# EAGLE design LocationMapper (EAGLE 8.6.0)
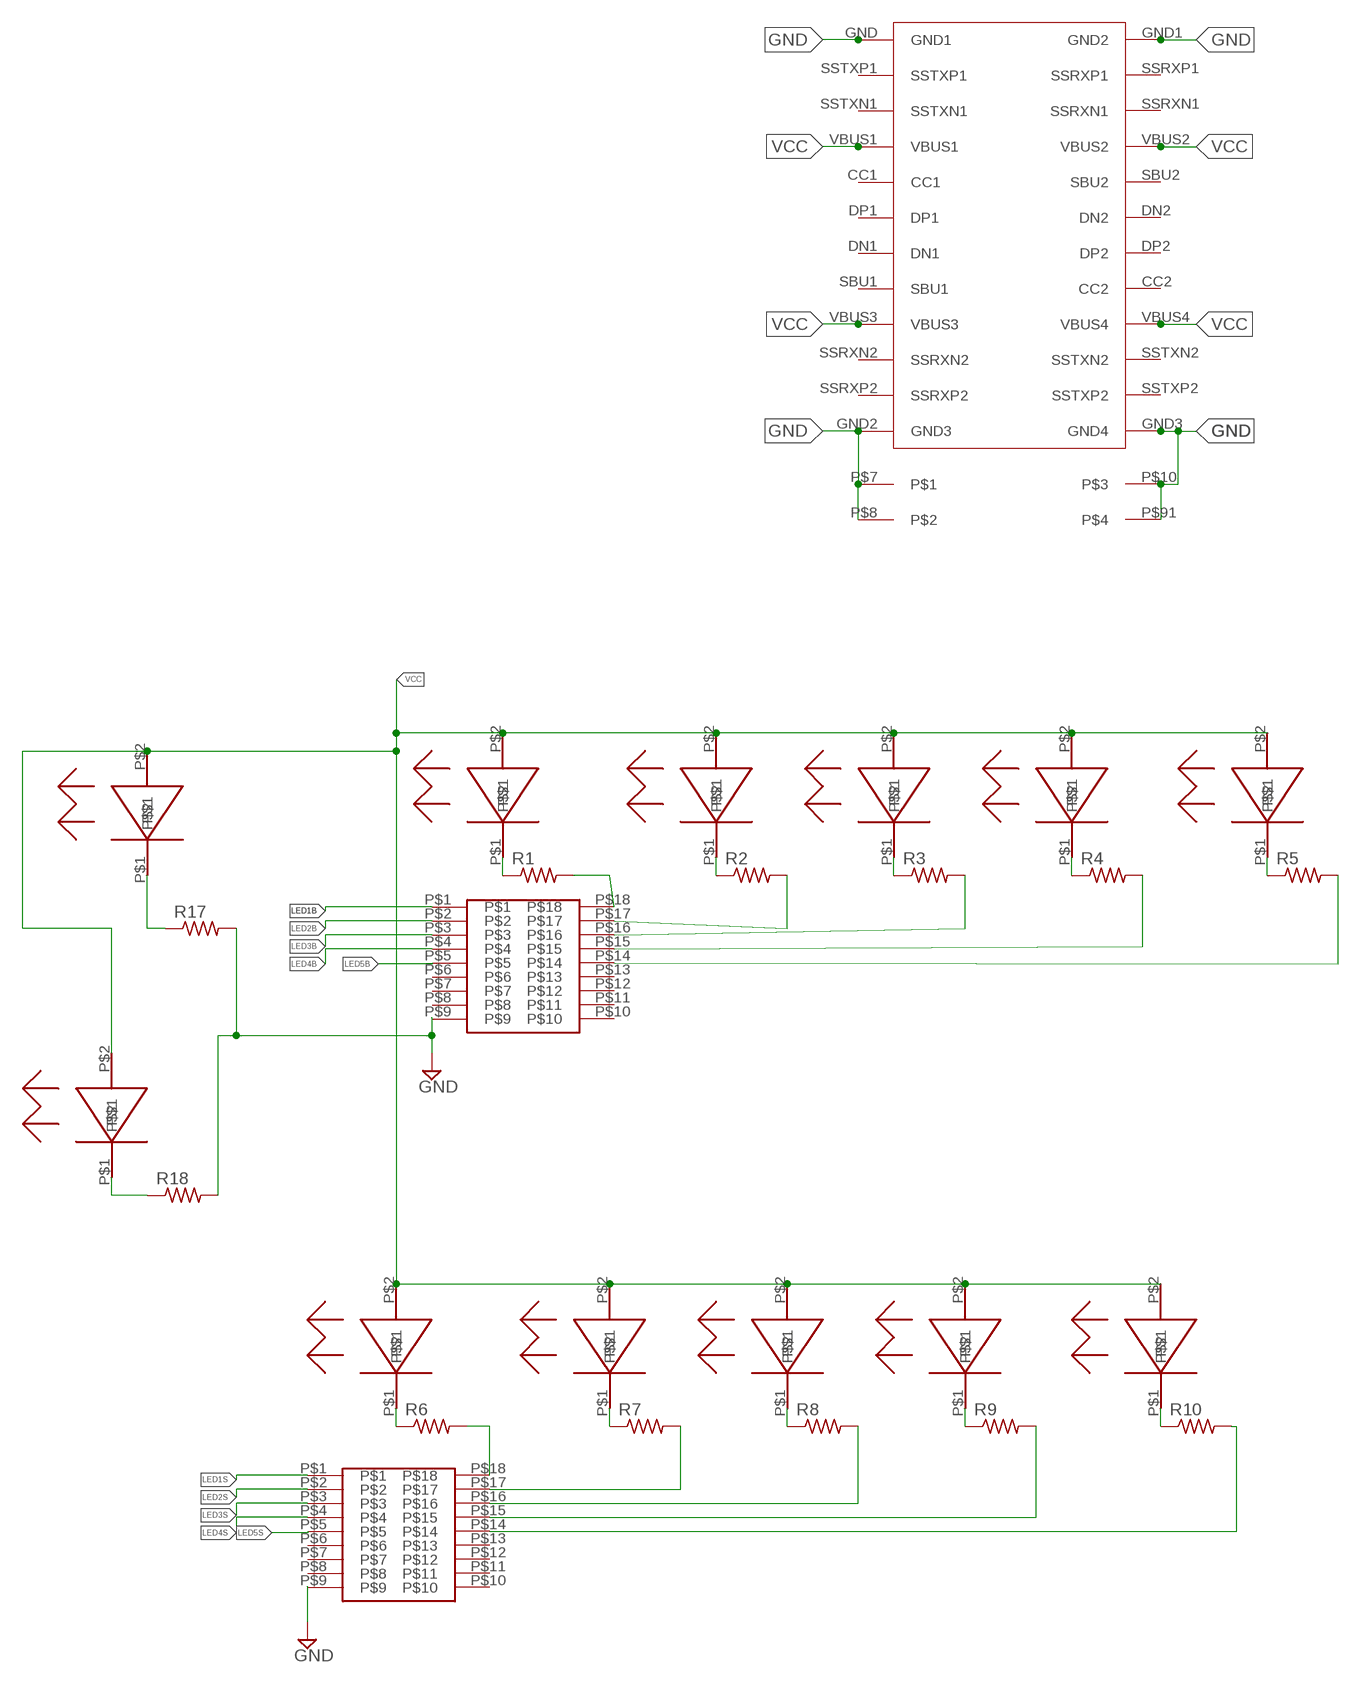
[diagram p0: schematic, sheet 1, part 1 of 2]
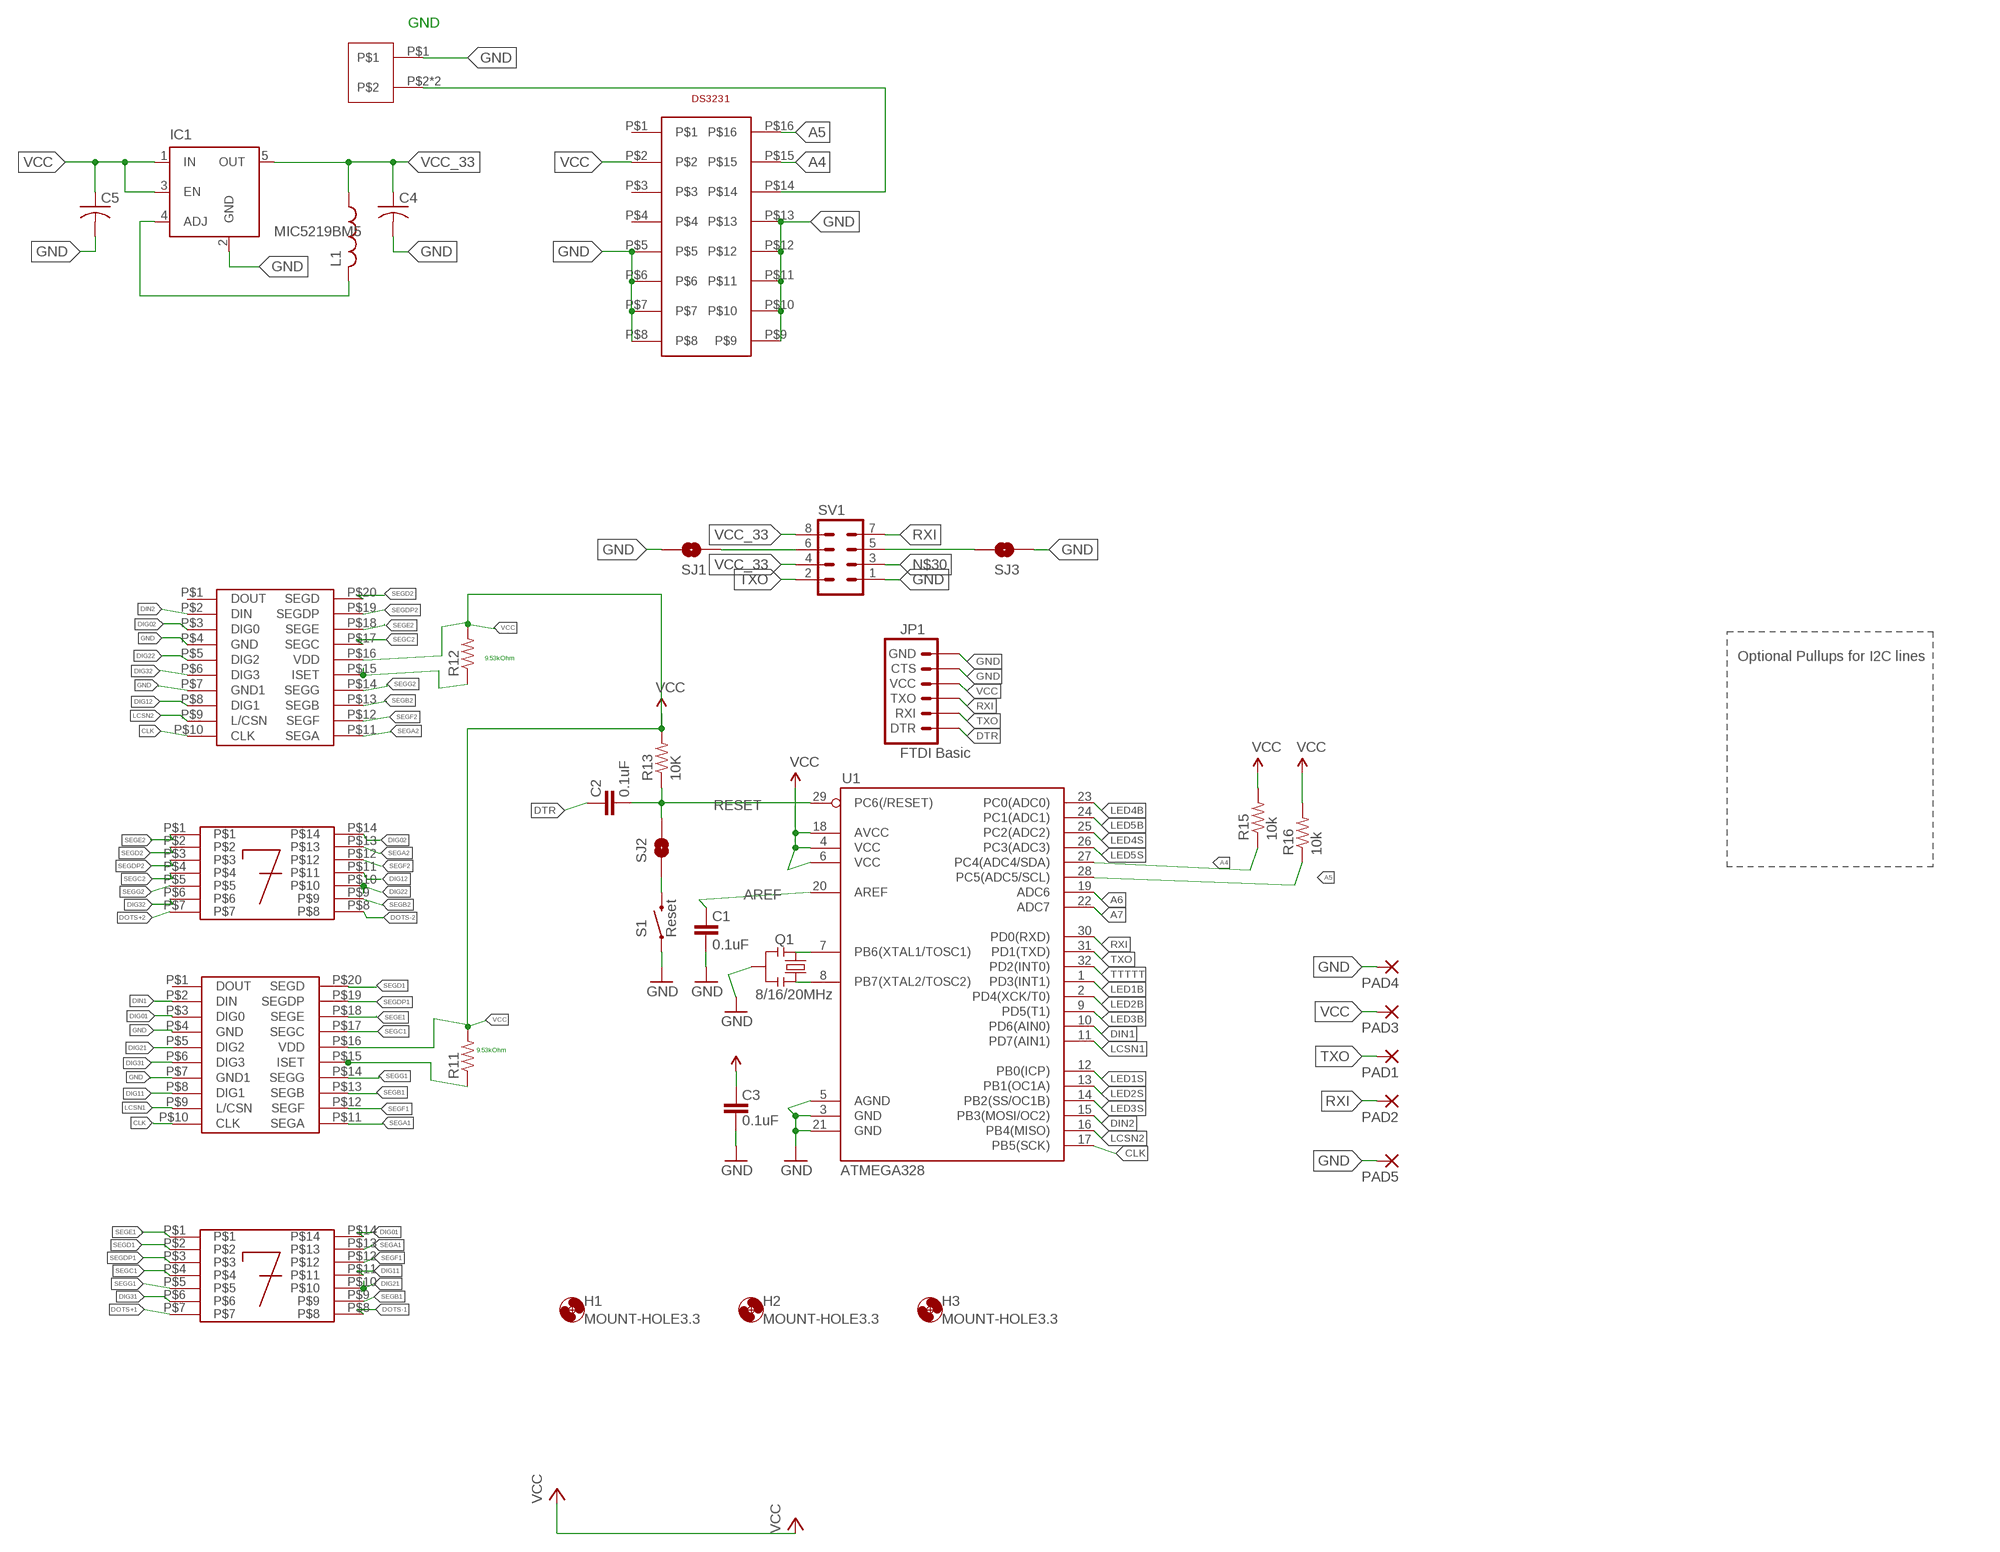
[diagram p1: schematic, sheet 1, part 2 of 2]

## Parts
C1  0.1uF  CAP0603-CAP  [0603-CAP]
C2  0.1uF  CAP0603-CAP  [0603-CAP]
C3  0.1uF  CAP0603-CAP  [0603-CAP]
C4  C-USC0805K  [C0805K]
C5  C-USC0805K  [C0805K]
H1  MOUNT-HOLE3.3  [3,3]
H2  MOUNT-HOLE3.3  [3,3]
H3  MOUNT-HOLE3.3  [3,3]
IC1  MIC5219BM5  [SOT23-5]
JP1  FTDI Basic  ARDUINO_SERIAL_PROGRAMPTH  [1X06]
L1  L-USL2012C  [L2012C]
PAD1  2,54/1,1  [2,54/1,1]
PAD2  2,54/1,1  [2,54/1,1]
PAD3  2,54/1,1  [2,54/1,1]
PAD4  2,54/1,1  [2,54/1,1]
PAD5  2,54/1,1  [2,54/1,1]
Q1  8/16/20MHz  RESONATOR1:1  [RESONATOR-SMD-1:1]
R1  R-US_R0805  [R0805]
R2  R-US_R0805  [R0805]
R3  R-US_R0805  [R0805]
R4  R-US_R0805  [R0805]
R5  R-US_R0805  [R0805]
R6  R-US_R0805  [R0805]
R7  R-US_R0805  [R0805]
R8  R-US_R0805  [R0805]
R9  R-US_R0805  [R0805]
R10  R-US_R0805  [R0805]
R11  R-US_R0805  [R0805]
R12  R-US_R0805  [R0805]
R13  10K  RESISTOR0603-RES  [0603-RES]
R15  10k  RESISTOR0603-RES  [0603-RES]
R16  10k  RESISTOR0603-RES  [0603-RES]
R17  R-US_R0805  [R0805]
R18  R-US_R0805  [R0805]
S1  Reset  SWITCH-MOMENTARY-2SMD-ALT01  [TACTILE-SWITCH-SMD-ALT01]
SJ1  SOLDERJUMPERNC  [SJ_2S]
SJ2  SOLDERJUMPERNC  [SJ_2S]
SJ3  SOLDERJUMPERNC  [SJ_2S]
SV1  MA04-2  [MA04-2]
U1  ATMEGA328  ATMEGA168  [TQFP32-08]
U$1  LED_LM  [LED_LM]
U$2  LED_LM  [LED_LM]
U$3  LED_LM  [LED_LM]
U$4  LED_LM  [LED_LM]
U$5  LED_LM  [LED_LM]
U$6  LED_LM  [LED_LM]
U$7  LED_LM  [LED_LM]
U$8  LED_LM  [LED_LM]
U$9  LED_LM  [LED_LM]
U$10  LED_LM  [LED_LM]
U$11  ULN2803A  [ULN2803A]
U$12  ULN2803A  [ULN2803A]
U$13  7SEG  [7SEG]
U$14  7SEG  [7SEG]
U$15  7SEG_DRIVER  [SO20W]
U$16  7SEG_DRIVER  [SO20W]
U$17  LED_LM  [LED_LM]
U$18  LED_LM  [LED_LM]
U$19  DS3231_BACK  [DS3231_BACK]
U$20  CR2032  [CR2032]
U$21  USB-C  [USB-C]

## Nets
A4: R15.1 U1.27(PC4(ADC4/SDA)) U$19.P$15
A5: R16.1 U1.28(PC5(ADC5/SCL)) U$19.P$16
A6: U1.19(ADC6)
A7: U1.22(ADC7)
AREF: C1.2 U1.20(AREF)
CLK: U1.17(PB5(SCK)) U$15.P$10(CLK) U$16.P$10(CLK)
DIG01: U$14.P$14 U$15.P$3(DIG0)
DIG02: U$13.P$14 U$16.P$3(DIG0)
DIG11: U$14.P$11 U$15.P$8(DIG1)
DIG12: U$13.P$11 U$16.P$8(DIG1)
DIG21: U$14.P$10 U$15.P$5(DIG2)
DIG22: U$13.P$10 U$16.P$5(DIG2)
DIG31: U$14.P$6 U$15.P$6(DIG3)
DIG32: U$13.P$6 U$16.P$6(DIG3)
DIN1: U1.10(PD6(AIN0)) U$15.P$2(DIN)
DIN2: U1.15(PB3(MOSI/OC2)) U$16.P$2(DIN)
DOTS+1: U$14.P$7
DOTS+2: U$13.P$7
DOTS-1: U$14.P$8
DOTS-2: U$13.P$8
DTR: C2.2 JP1.1(DTR)
GND: C1.1 C3.1 C4.2 C5.2 IC1.2(GND) JP1.5(CTS) JP1.6(GND) PAD4.1(P) PAD5.1(P) Q1.2 R17.2 R18.2 S1.1 S1.2 SJ1.2 SJ3.1 SV1.1 U1.3(GND) U1.5(AGND) U1.21(GND) U$11.P$9 U$12.P$9 U$15.P$4(GND) U$15.P$7(GND1) U$16.P$4(GND) U$16.P$7(GND1) U$19.P$5 U$19.P$6 U$19.P$7 U$19.P$8 U$19.P$9 U$19.P$10 U$19.P$11 U$19.P$12 U$19.P$13 U$20.P$1 U$21.GND1(GND2) U$21.GND2(GND3) U$21.GND3(GND4) U$21.GND(GND1) U$21.P$7 U$21.P$8 U$21.P$10 U$21.P$91
LCSN1: U1.11(PD7(AIN1)) U$15.P$9(L/CSN)
LCSN2: U1.16(PB4(MISO)) U$16.P$9(L/CSN)
LED1B: U1.1(PD3(INT1)) U$11.P$1
LED1S: U1.12(PB0(ICP)) U$12.P$1
LED2B: U1.2(PD4(XCK/T0)) U$11.P$2
LED2S: U1.13(PB1(OC1A)) U$12.P$2
LED3B: U1.9(PD5(T1)) U$11.P$3
LED3S: U1.14(PB2(SS/OC1B)) U$12.P$3
LED4B: U1.23(PC0(ADC0)) U$11.P$4
LED4S: U1.25(PC2(ADC2)) U$12.P$4
LED5B: U1.24(PC1(ADC1)) U$11.P$5
LED5S: U1.26(PC3(ADC3)) U$12.P$5
N$1: R1.1 U$6.P$1
N$2: R2.1 U$7.P$1
N$3: R3.1 U$8.P$1
N$4: R4.1 U$9.P$1
N$5: R5.1 U$10.P$1
N$6: R6.1 U$1.P$1
N$7: R7.1 U$2.P$1
N$8: R8.1 U$3.P$1
N$9: R9.1 U$4.P$1
N$10: R10.1 U$5.P$1
N$11: U$19.P$14 U$20.P$2 U$20.P$3
N$12: R1.2 U$11.P$18
N$13: R2.2 U$11.P$17
N$14: R3.2 U$11.P$16
N$15: R4.2 U$11.P$15
N$16: R5.2 U$11.P$14
N$17: R6.2 U$12.P$18
N$18: R7.2 U$12.P$17
N$19: R8.2 U$12.P$16
N$20: R9.2 U$12.P$15
N$21: R10.2 U$12.P$14
N$22: R18.1 U$18.P$1
N$23: R12.1 U$16.P$15(ISET)
N$24: Q1.3 U1.8(PB7(XTAL2/TOSC2))
N$25: Q1.1 U1.7(PB6(XTAL1/TOSC1))
N$26: S1.3 S1.4 SJ2.1
N$27: R17.1 U$17.P$1
N$29: SJ3.2 SV1.5
N$30: SV1.3
N$31: IC1.4(ADJ) L1.2
N$36: R11.1 U$15.P$15(ISET)
RESET: C2.1 R13.1 SJ2.2 U1.29(PC6(/RESET))
RESET_WIFI: SJ1.1 SV1.6
RXI: JP1.3(TXO) PAD2.1(P) SV1.7 U1.30(PD0(RXD))
SEGA1: U$14.P$13 U$15.P$11(SEGA)
SEGA2: U$13.P$13 U$16.P$11(SEGA)
SEGB1: U$14.P$9 U$15.P$13(SEGB)
SEGB2: U$13.P$9 U$16.P$13(SEGB)
SEGC1: U$14.P$4 U$15.P$17(SEGC)
SEGC2: U$13.P$4 U$16.P$17(SEGC)
SEGD1: U$14.P$2 U$15.P$20(SEGD)
SEGD2: U$13.P$2 U$16.P$20(SEGD)
SEGDP1: U$14.P$3 U$15.P$19(SEGDP)
SEGDP2: U$13.P$3 U$16.P$19(SEGDP)
SEGE1: U$14.P$1 U$15.P$18(SEGE)
SEGE2: U$13.P$1 U$16.P$18(SEGE)
SEGF1: U$14.P$12 U$15.P$12(SEGF)
SEGF2: U$13.P$12 U$16.P$12(SEGF)
SEGG1: U$14.P$5 U$15.P$14(SEGG)
SEGG2: U$13.P$5 U$16.P$14(SEGG)
TTTTT: U1.32(PD2(INT0))
TXO: JP1.2(RXI) PAD1.1(P) SV1.2 U1.31(PD1(TXD))
VCC: C3.2 C5.1 IC1.1(IN) IC1.3(EN) JP1.4(VCC) PAD3.1(P) R11.2 R12.2 R13.2 R15.2 R16.2 U1.4(VCC) U1.6(VCC) U1.18(AVCC) U$1.P$2 U$2.P$2 U$3.P$2 U$4.P$2 U$5.P$2 U$6.P$2 U$7.P$2 U$8.P$2 U$9.P$2 U$10.P$2 U$15.P$16(VDD) U$16.P$16(VDD) U$17.P$2 U$18.P$2 U$19.P$2 U$21.VBUS1 U$21.VBUS2 U$21.VBUS3 U$21.VBUS4
VCC_33: C4.1 IC1.5(OUT) L1.1 SV1.4 SV1.8
Unconnected: U$11.P$6 U$11.P$7 U$11.P$8 U$11.P$10 U$11.P$11 U$11.P$12 U$11.P$13 U$12.P$6 U$12.P$7 U$12.P$8 U$12.P$10 U$12.P$11 U$12.P$12 U$12.P$13 U$15.P$1(DOUT) U$16.P$1(DOUT) U$19.P$1 U$19.P$3 U$19.P$4 U$21.CC1 U$21.CC2 U$21.DN1 U$21.DN2 U$21.DP1 U$21.DP2 U$21.SBU1 U$21.SBU2 U$21.SSRXN1 U$21.SSRXN2 U$21.SSRXP1 U$21.SSRXP2 U$21.SSTXN1 U$21.SSTXN2 U$21.SSTXP1 U$21.SSTXP2

## Notes on the sheet
- GND
- 9.53kOhm | Optional Pullups for I2C lines
- 9.53kOhm

## Library data of the parts
C1-C3 = SparkFun:CAP: Capacitor Standard 0603 ceramic capacitor, and 0.1" leaded capacitor.
C4 C5 = resistor:C-US: CAPACITOR, American symbol
H1-H3 = holes:MOUNT-HOLE: MOUNTING HOLE with drill center marker
IC1 = v-reg-micrel:MIC5219BM5: VOLTAGE REGULATOR; MF: ALTERA CORPORATION; MPN: MIC5219BM5 TR; OC_FARNELL: 1100656; OC_NEWARK: 09J8939
JP1 = SparkFun:ARDUINO_SERIAL_PROGRAM
L1 = rcl:L-US: INDUCTOR, American symbol; SPICEPREFIX: L
PAD1-PAD5 = wirepad:2,54/1,1: THROUGH-HOLE PAD
Q1 = Testing:RESONATOR: Resonator Small SMD resonator. This is the itty bitty 10/20MHz resonators with built in caps. CSTCE10M0G55 and CSTCE20M0V53. Footprint for SMD has been used in SFE production for years, and does work okay. 1:1 is an attempt to get larger fillets on the sides so it will be easier to inspect these solders in our AOI machine. The pads have been minimized to match the actual metal under the resonator. To see this relation, it includes an image import of the bottom side of the component. Imported to scale on layer 200.
R1-R12 R17 R18 = resistor:R-US_: RESISTOR, American symbol
R13 R15 R16 = SparkFun:RESISTOR: Resistor Basic schematic elements and footprints for 0603, 1206, and PTH resistors.
S1 = Testing:SWITCH-MOMENTARY-2: Various NO switches- pushbuttons, reed, etc
SJ1-SJ3 = SparkFun-Passives:SOLDERJUMPER: Solder Jumper Standard SMD solder jumper. Used to automate production. Two varients : Normally Open and Normally Closed are the same, but have different paste layers. NC will have a large amount of paste and should jumper during reflow.
SV1 = con-lstb:MA04-2: PIN HEADER; OC_FARNELL: unknown; OC_NEWARK: unknown
U1 = SparkFun:ATMEGA168
U$1-U$10 U$17 U$18 = LED_LM:LED_LM
U$11 U$12 = ULN2803A:ULN2803A
U$13 U$14 = 7SEG:7SEG
U$15 U$16 = 7SEG_DRIVER:7SEG_DRIVER
U$19 = DS3231_BACK:DS3231_BACK
U$20 = CR2032:CR2032
U$21 = USB-C:USB-C

## Net classes
0 default: width 0.203 mm, drill 0.203 mm, clearance 0.203 mm
1 vcc: width 0.254 mm

## Board
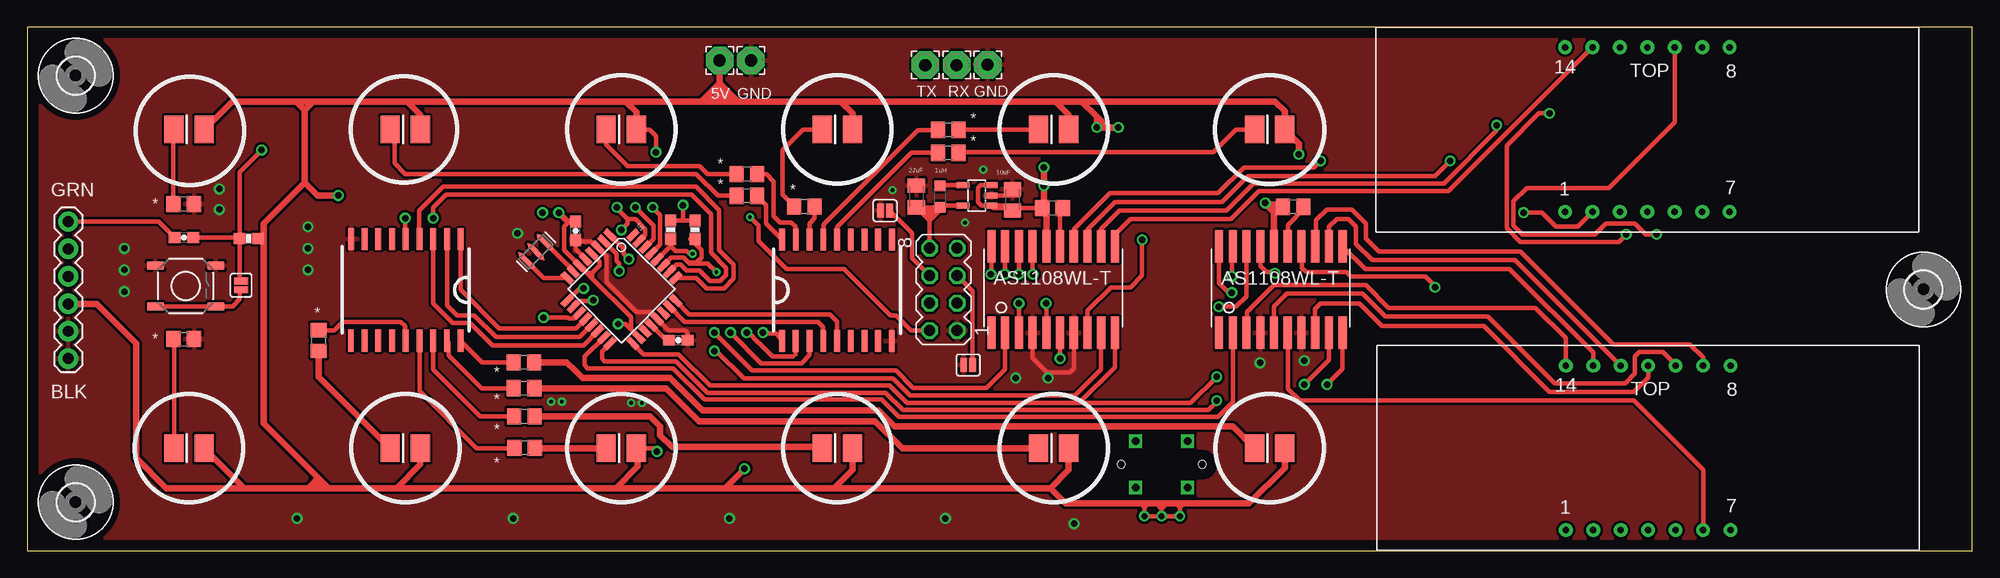
[diagram p2: board, top side]
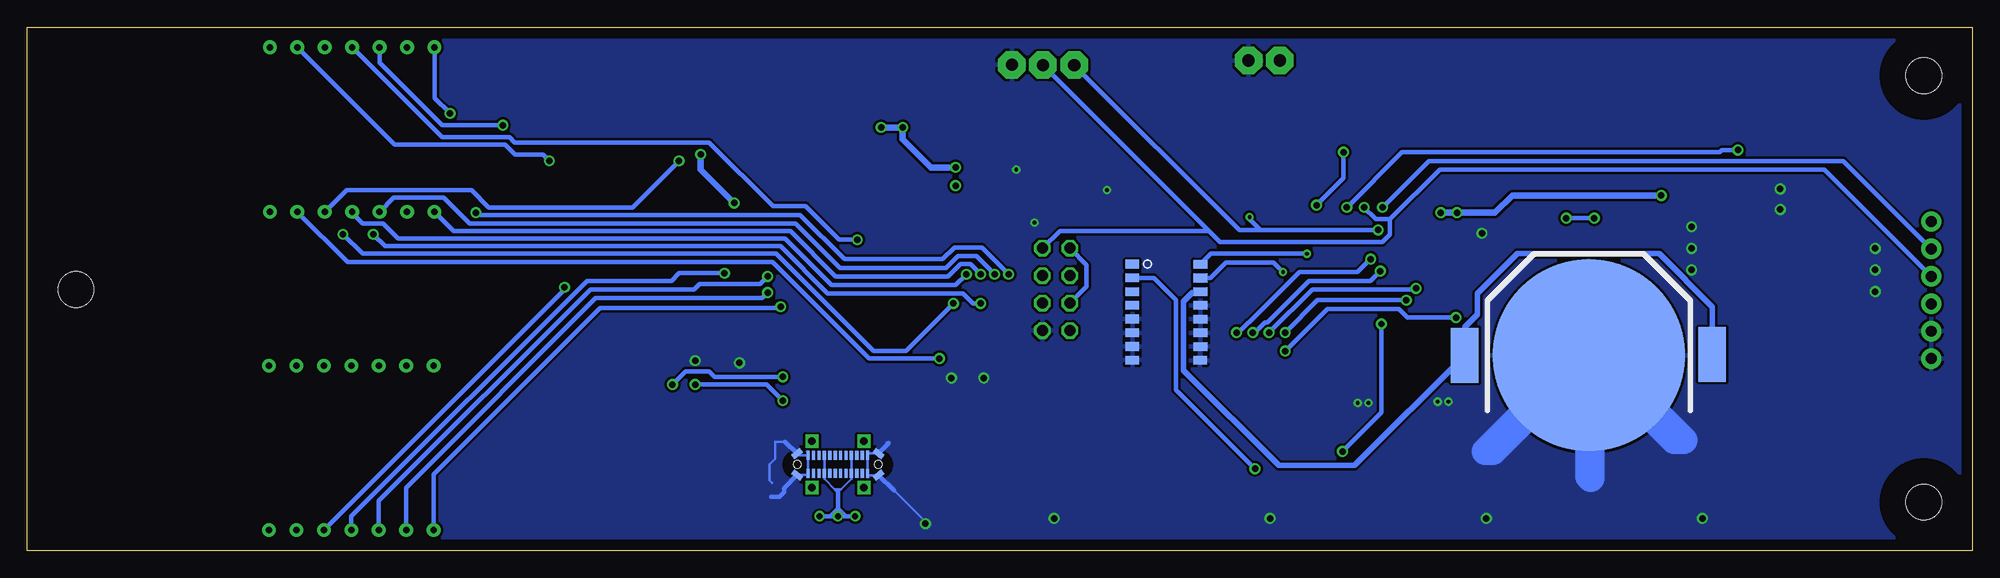
[diagram p3: board, bottom side, seen from below]

Size 180.04 x 48.5 mm. Coordinates in mm from the lower left corner, seen from the top.
Outline: 0,0 180.04,0 180.04,48.5 0,48.5 0,0
Copper layers (1*16): Top 0.035mm / dielectric 1.5mm / Bottom 0.035mm
Design rules "default *": minimum track width 6mil, minimum drill 0.35mm, track to track 9mil, track to pad 9mil, pad to pad 9mil, via to via 9mil, smd to smd 9mil, copper to edge 40mil, drill to drill 6mil, minimum pad ring 10mil, minimum via ring 8mil, stop-mask expansion 4mil, vias tented up to drill 0mil, thermal gap 10mil

### Footprints (pad centres in the part's own frame; a part is rotated, then mirrored left to right if it is on the bottom)
0603-CAP = smd 1.1 x 1: 1 -0.85,0; 2 0.85,0
C0805K = smd 1.3 x 1.6: 1 -1,0; 2 1,0
3,3 = hole 3.3: 0,0
SOT23-5 = smd 0.55 x 1.2: 1 -0.95,-1.3; 2 0,-1.3; 3 0.95,-1.3; 4 0.95,1.3; 5 -0.95,1.3
1X06 = drill 1.016 pad 1.88: 1 0,0; 2 2.54,0; 3 5.08,0; 4 7.62,0; 5 10.16,0; 6 12.7,0
L2012C = smd 1 x 1: 1 -1,0; 2 1,0
2,54/1,1 = drill 1.118 pad 2.54 octagon: 1 0,0
RESONATOR-SMD-1:1 = smd 0.45 x 1.905: 1 -1.2,0; 2 0,0; 3 1.2,0
R0805 = smd 1.3 x 1.5: 1 -0.95,0; 2 0.95,0
0603-RES = smd 1.1 x 1: 1 -0.85,0; 2 0.85,0
TACTILE-SWITCH-SMD-ALT01 = smd 1.524 x 0.762: 1 -2.794,1.905; 2 2.794,1.905; 3 -2.794,-1.905; 4 2.794,-1.905
SJ_2S = smd 0.635 x 1.27: 1 -0.412,0; 2 0.412,0
MA04-2 = drill 1.016 octagon: 1 -3.81,-1.27; 2 -3.81,1.27; 3 -1.27,-1.27; 4 -1.27,1.27; 5 1.27,-1.27; 6 1.27,1.27; 7 3.81,-1.27; 8 3.81,1.27
TQFP32-08 = smd 1.27 x 0.559: 1 -4.293,2.8; 2 -4.293,2; 3 -4.293,1.2; 4 -4.293,0.4; 5 -4.293,-0.4; 6 -4.293,-1.2; 7 -4.293,-2; 8 -4.293,-2.8; 17 4.293,-2.8; 18 4.293,-2; 19 4.293,-1.2; 20 4.293,-0.4; 21 4.293,0.4; 22 4.293,1.2; 23 4.293,2; 24 4.293,2.8 | smd 0.559 x 1.27: 9 -2.8,-4.293; 10 -2,-4.293; 11 -1.2,-4.293; 12 -0.4,-4.293; 13 0.4,-4.293; 14 1.2,-4.293; 15 2,-4.293; 16 2.8,-4.293; 25 2.8,4.293; 26 2,4.293; 27 1.2,4.293; 28 0.4,4.293; 29 -0.4,4.293; 30 -1.2,4.293; 31 -2,4.293; 32 -2.8,4.293
LED_LM = smd 1.778 x 2.54: P$1 -1.397,0; P$2 1.397,0
ULN2803A = smd 0.55 x 1.95: P$1 -5.08,-4.71; P$2 -3.82,-4.71; P$3 -2.54,-4.71; P$4 -1.27,-4.71; P$5 0,-4.71; P$6 1.27,-4.71; P$7 2.54,-4.71; P$8 3.81,-4.71; P$9 5.07,-4.71; P$10 5.08,4.7; P$11 3.8,4.7; P$12 2.54,4.7; P$13 1.27,4.7; P$14 0,4.7; P$15 -1.27,4.7; P$16 -2.54,4.7; P$17 -3.81,4.7; P$18 -5.08,4.7
7SEG = drill 0.6 pad 1.27: P$1 -7.62,-7.62; P$2 -5.08,-7.62; P$3 -2.54,-7.62; P$4 0,-7.62; P$5 2.54,-7.62; P$6 5.08,-7.62; P$7 7.62,-7.62; P$8 7.62,7.62; P$9 5.08,7.62; P$10 2.54,7.62; P$11 0,7.62; P$12 -2.54,7.62; P$13 -5.08,7.62; P$14 -7.62,7.62
SO20W = smd 0.75 x 3: P$1 -5.71,-4; P$2 -4.44,-4; P$3 -3.17,-4; P$4 -1.9,-4; P$5 -0.63,-4; P$6 0.64,-4; P$7 1.91,-4; P$8 3.18,-4; P$9 4.45,-4; P$10 5.72,-4; P$11 5.72,4.01; P$12 4.45,4.01; P$13 3.18,4.01; P$14 1.91,4.01; P$15 0.64,4.01; P$16 -0.63,4.01; P$17 -1.9,4.01; P$18 -3.17,4.01; P$19 -4.44,4.01; P$20 -5.71,4.01
DS3231_BACK = smd 0.8 x 1.27 bottom: P$1 4.45,-3.15; P$2 3.17,-3.15; P$3 1.9,-3.15; P$4 0.64,-3.15; P$5 -0.64,-3.15; P$6 -1.91,-3.15; P$7 -3.18,-3.15; P$8 -4.45,-3.15; P$9 -4.46,3.12; P$10 -3.19,3.15; P$11 -1.92,3.15; P$12 -0.65,3.15; P$13 0.62,3.15; P$14 1.89,3.15; P$15 3.16,3.15; P$16 4.43,3.15
CR2032 = smd 17.78 x 17.78 bottom: P$1 0,0 | smd 2.54 x 5.08 bottom: P$2 11.481,0; P$3 -11.405,0.076
USB-C = smd 0.3 x 0.85 bottom: CC1 0.75,0.83; CC2 -0.75,-0.83; DN1 -0.25,0.83; DN2 0.25,-0.83; DP1 0.25,0.83; DP2 -0.25,-0.83; GND -2.75,-0.83; GND1 2.75,0.83; GND2 2.75,-0.83; GND3 -2.75,0.83; SBU1 -0.75,0.83; SBU2 0.75,-0.83; SSRXN1 1.75,-0.83; SSRXN2 -1.75,0.83; SSRXP1 2.25,-0.83; SSRXP2 -2.25,0.83; SSTXN1 1.75,0.83; SSTXN2 -1.75,-0.83; SSTXP1 2.25,0.83; SSTXP2 -2.25,-0.83; VBUS1 1.25,0.83; VBUS2 1.25,-0.83; VBUS3 -1.25,0.83; VBUS4 -1.25,-0.83 | smd 1.03 x 0.5 rotated 219 bottom: P$7 -3.77,1; P$10 3.76,-0.99 | smd 1.03 x 0.5 rotated 321 bottom: P$8 -3.77,-1; P$91 3.77,1 | drill 0.7 pad 1.016 square: P$9 2.4,-2.15; P$11 -2.4,-2.15; P$12 -2.4,2.15; P$13 2.4,2.15 | hole 0.7: -3.75,0; 3.75,0

### Placement (x,y rotation side)
C1  60.27,19.49 180 top
C2  14.52,28.99 180 top
C3  50.77,29.62 90 top
C4  82.3,32.8 90 top
C5  91.2,32.5 90 top
H1  4.5,4.5 0 top
H2  4.5,44 0 top
H3  175.5,24.2 0 top
IC1  87.9,32.9 90 top
JP1  3.82,30.49 270 top
L1  84.5,32.8 90 top
PAD1  83.13,44.98 0 top
PAD2  86.03,44.98 0 top
PAD3  64.1,45.4 0 top
PAD4  67,45.4 0 top
PAD5  88.9,45 0 top
Q1  47.1,27.69 225 top
R1  66.61,32.87 0 top
R2  66.63,34.87 0 top
R3  71.95,31.87 0 top
R4  85.27,38.97 180 top
R5  85.26,36.85 180 top
R6  45.98,17.45 180 top
R7  46,15.05 180 top
R8  46.02,12.45 180 top
R9  46.05,9.54 180 top
R10  26.99,19.47 90 top
R11  94.9,31.74 180 top
R12  117.17,31.85 180 top
R13  20.52,28.92 0 top
R15  61.82,29.72 90 top
R16  59.57,29.72 90 top
R17  14.5,32.1 0 top
R18  14.5,19.6 0 top
S1  14.68,24.52 0 top
SJ1  79.4,31.5 180 top
SJ2  19.81,24.58 90 top
SJ3  87.1,17.2 0 top
SV1  84.8,24.2 90 top
U1  55.01,24.22 315 top
U$1  115,9.5 0 top
U$2  95,9.5 0 top
U$3  75,9.5 0 top
U$4  55,9.5 0 top
U$5  35,9.5 0 top
U$6  35,39 0 top
U$7  55,39 0 top
U$8  75,39 0 top
U$9  95,39 0 top
U$10  115,39 0 top
U$11  74.96,24.14 0 top
U$12  35.05,24.15 180 top
U$13  150.03,9.53 0 top
U$14  149.95,39 0 top
U$15  94.96,24.19 0 top
U$16  116.03,24.18 0 top
U$17  15,39 0 top
U$18  15,9.5 0 top
U$19  74.6,22.1 90 top
U$20  35.5,18.1 0 top
U$21  105,8 0 top

### Tracks (layer width: path | path; a pad name or v marks a point on that pad's centre or on a via)
A4  (via drill 0.35)
  Top 0.406: 61.36,28.87 R15.1 | 61.8,28.85 R15.1 | 61.21,26.69 61.3,26.6 63,26.6 v63.8,25.8 | U1.27 59.62,27.14 60.77,27.14 61.21,26.69 | R15.1 61.82,28.43 62.41,27.84 62.41,27.16 61.94,26.69 61.21,26.69
  Bottom 0.406: v63.8,25.8 64.7,26.7 69.1,26.7 70.54,25.26 U$19.P$15
A5  (via drill 0.35)
  Top 0.406: 58.37,26.97 U1.28 59.57,28.21 | 59.87,28.51 R16.1 59.57,28.21 | v61.6,27.5 61.3,27.5 61.03,27.77 60.01,27.77 59.57,28.21
  Bottom 0.406: v61.6,27.5 70.48,27.5 U$19.P$16
AREF
  Top 0.406: C1.2 59.17,19.49 U1.20
CLK  (via drill 0.6)
  Top 0.406: U1.17 57.07,18.2 60.3,18.2 63.2,15.3 79.8,15.3 81.43,13.67 97.37,13.67 | U$15.P$10 100.68,16.98 97.37,13.67 | 97.37,13.67 107.67,13.67 v110.1,16.1 | v120.3,15.4 121.75,16.85 U$16.P$10
  Bottom 0.406: v120.3,15.4 119.1,16.6 116.9,16.6 116.4,16.1 v110.1,16.1
DIG01  (via drill 0.6)
  Top 0.406: U$15.P$3 v91.79,22.89 v91.8,22.9 | v148,29.3 147.3,28.6 138.2,28.6 136.93,29.87 136.93,37.53 139.9,40.5 v140.9,40.5
  Bottom 0.406: v91.8,22.9 92.5,22.9 93.44,23.84 105.94,23.84 110.3,28.2 146.9,28.2 v148,29.3 | U$14.P$14 142.33,42.5 142.33,42.23 142.33,41.93 v140.9,40.5
DIG02
  Top 0.406: U$13.P$14 142.41,19.69 139.6,22.5 126,22.5 123.9,24.6 115.4,24.6 112.9,22.1 | 112.9,22.1 113.3,22.5 | 112.9,22.1 112.9,20.22 U$16.P$3
DIG11  (via drill 0.6)
  Top 0.406: U$15.P$8 98.14,22.24 100.3,24.4 102.1,24.4 103.2,25.5 v103.2,28.8
  Bottom 0.406: v103.2,28.8 104.9,28.8 108,31.9 111,31.9 116.9,37.8 134.9,37.8 135.4,38.3 141.63,38.3 U$14.P$11
DIG12
  Top 0.406: U$13.P$11 150.03,16.03 148.7,14.7 140.9,14.7 134.8,20.8 125.4,20.8 123.3,22.9 119.7,22.9 119.2,22.4 U$16.P$8 | U$16.P$8
DIG21  (via drill 0.6)
  Top 0.406: U$15.P$5 94.33,22.87 v94.3,22.9 | v150.8,29.3 149.8,29.3 148.8,30.3 146.1,30.3 145.1,29.3 138.4,29.3 137.56,30.14 137.56,32.37 138.8,33.6 146.4,33.6 152.49,39.69 U$14.P$10
  Bottom 0.406: v94.3,22.9 98.7,18.5 101.7,18.5 110.7,27.5 149,27.5 v150.8,29.3
DIG22
  Top 0.406: U$13.P$10 152.57,17.23 151.4,18.4 149.2,18.4 148.8,18 148.8,16.4 147.9,15.5 141.4,15.5 135.2,21.7 125.7,21.7 123.6,23.8 116.6,23.8 115.4,22.6 U$16.P$5
DIG31  (via drill 0.6)
  Top 0.406: U$15.P$6 v95.6,17.8
  Bottom 0.406: v95.6,17.8 102.1,17.8 111.03,26.73 150.38,26.73 U$14.P$6
DIG32
  Top 0.406: U$16.P$6 116.7,20.15 116.7,15 117.8,13.9 148.7,13.9 155.11,7.49 U$13.P$6 154.99,1.91
DIN1  (via drill 0.6)
  Top 0.406: U1.10 50.69,22.6 51.2,23.11 52.31,23.11 v52.4,23.2 | v63.6,20.2 67.1,16.7 80.4,16.7 82,15.1 88.8,15.1 90.5,16.8 90.5,18.1 90.52,18.12 U$15.P$2
  Bottom 0.406: v52.4,23.2 60.6,23.2 v63.6,20.2
DIN2
  Top 0.406: U1.15 51.6,17.98 51.6,17.2 51.9,16.9 59.8,16.9 62.7,14 79.1,14 80.7,12.4 110.2,12.4 111.59,13.79 U$16.P$2
DTR
  Top 0.406: C2.2 12.17,30.49 JP1.1
GND  (via drill 0.35, 0.6)
  Top 0.406: U1.5 51.69,27.01 50.77,27.93 C3.1 50.92,28.62 52.19,28.62 52.7,28.1 U1.3 53.63,27.29 53.63,24.86 56.4,22.1 57.7,22.1 U1.21 59.37,20.42 60.88,20.42 61.12,20.18 C1.1 | U$15.P$4 93.06,17.84 94.4,16.5 96.5,16.5 96.87,16.87 U$15.P$7 | C5.2 90.6,32.9 IC1.2 91.8,32.9
  Bottom 0.254: U$21.P$10 107.91,7.01 U$21.GND2 U$21.GND1 108.6,8.83 U$21.P$91 | U$21.P$7 102.08,9 U$21.GND3 U$21.GND 102.08,7 U$21.P$8 | 99.81,5.58 96.9,2.67 v96.9,2.5 | 100.3,10 100.5,10 | 109.9,10.1 110.8,10.1 110.8,8.5 111.3,8 111.3,6.5 111.1,6.3
  Bottom 0.406: U$21.P$8 99.81,5.58 | U$21.P$7 100.3,9.93 100.3,10 | U$21.P$91 109.87,10.1 109.9,10.1 | U$21.P$10 110,5.77 110,5.4 110.4,5 111.2,5
  Bottom 2.54: U$20.P$1 35.5,6.9 35.3,6.7 35.3,17.9 U$20.P$1 | U$20.P$1 27.6,10.2 26.7,10.2 34.6,18.1 U$20.P$1 | U$20.P$1 44.4,9.2 45.1,9.2 36.2,18.1 U$20.P$1
  other vias: 118.2,17.6 114.1,17.4 45.4,29.4 26,30 26,28 26,26 17.8,33.5 17.8,31.6 9,28 9,26 9,24 25,3 45,3 65,3 85,3 94.5,16 91.5,16 48.5,13.8 49.5,13.8 55.9,13.7 56.9,13.7 80.1,33.4 88.5,35.3 86.8,30.4
  pour Top: 0,48.5 0,0 180,0 180,48.5
  pour Bottom: -0.1,48.6 -0.1,-0.1 180.1,-0.1 180.1,48.6
LCSN1  (via drill 0.6)
  Top 0.406: v47.8,21.6 50.05,21.6 50.13,21.52 50.61,21.52 U1.11 | v63.6,18.5 63.77,18.5 66.34,15.94 80.17,15.94 81.7,14.4 97,14.4 99.41,16.81 U$15.P$9
  Bottom 0.406: v47.8,21.6 52.3,21.6 53.1,22.4 59.7,22.4 v63.6,18.5
LCSN2  (via drill 0.6)
  Top 0.406: U1.16 53.2,18.45 53.2,17.8 53.47,17.54 60.06,17.54 62.96,14.63 79.47,14.63 81.06,13.04 109.33,13.04 110.1,13.8 v110.1,13.9 | v118.2,15.4 120.48,17.68 U$16.P$9
  Bottom 0.406: v110.1,13.9 111.6,15.4 v118.2,15.4
LED1B  (via drill 0.6)
  Top 0.406: v68.1,20.2 68.2,20.1 69.3,20.1 69.88,19.52 U$11.P$1 | v55.7,27 55.2,27.5 55.2,27.99 U1.1
  Bottom 0.406: v68.1,20.2 67.92,20.2 66.99,21.14 66.97,21.14 62.3,25.8 56.9,25.8 v55.7,27
LED1S
  Top 0.406: U1.12 50.82,20.6 43.7,20.6 40.13,24.17 U$12.P$1
LED2B  (via drill 0.6)
  Top 0.406: U$11.P$2 71.1,19.39 71.1,18.2 70.9,18 69,18 67.73,19.27 67.71,19.27 66.78,20.2 v66.6,20.2 | v54.8,25.9 54.8,26.58 54.56,26.81 54.56,27.49 U1.2
  Bottom 0.406: v66.6,20.2 66.42,20.2 65.49,21.14 65.27,21.14 61.4,25 55.7,25 v54.8,25.9
LED2S
  Top 0.406: U1.13 51.16,19.8 43.4,19.8 41.4,21.8 39.8,21.8 38.87,22.73 U$12.P$2
LED3B  (via drill 0.6)
  Top 0.406: U$11.P$3 72.42,18.12 71.67,17.36 67.94,17.36 v65.1,20.2 | U1.9 51.13,24.3 v51.5,24.3
  Bottom 0.406: v65.1,20.2 61.1,24.2 51.6,24.2 v51.5,24.3
LED3S
  Top 0.406: U1.14 51.49,19 43.1,19 41,21.1 39.4,21.1 37.59,22.91 U$12.P$3
LED4B
  Top 0.406: U1.23 60.86,21.2 73.2,21.2 73.69,20.71 U$11.P$4
LED4S
  Top 0.406: U$12.P$4 36.3,28.88 36.3,31.5 38.5,33.7 61.9,33.7 64.06,31.54 64.06,27.84 65.4,26.5 65.4,25.2 64.5,24.3 62.9,24.3 61.92,25.27 U1.25
LED5B
  Top 0.406: U1.24 61.29,21.9 74.3,21.9 74.96,21.24 U$11.P$5
LED5S  (via drill 0.6)
  Top 0.406: v37.6,30.8 37.6,31.8 38.8,33 61.5,33 63.3,31.2 63.3,27.6 64.7,26.2 64.7,25.55 64.14,24.99 63.21,24.99 62.23,25.96 61.04,25.96 61,26 60.5,26.5 60.12,26.5 U1.26 | v35,30.8 35,28.91 U$12.P$5
  Bottom 0.406: v35,30.8 v37.6,30.8
N$1
  Top 0.406: U$6.P$1 34,38.6 34,35.9 35,34.9 61.9,34.9 63.93,32.87 R1.1
N$2
  Top 0.406: U$7.P$1 53.6,37.6 55.6,35.6 62.25,35.6 62.98,34.87 R2.1
N$3
  Top 0.406: R3.1 69.9,32.97 69.9,37.1 71.8,39 U$8.P$1
N$4
  Top 0.406: R4.1 86.25,39 U$9.P$1
N$5
  Top 0.406: U$10.P$1 111.9,39 109.8,36.9 88.8,36.9 88.56,36.9 86.26,36.9 R5.1
N$6
  Top 0.61: R6.1 49.95,17.45 50.7,16.7 51.4,16 59.5,16 62.5,13 78.8,13 80.3,11.5 111.6,11.5 U$1.P$1
N$7
  Top 0.61: U$2.P$1 81,9.5 78.5,12 62.2,12 59.15,15.05 R7.1
N$8
  Top 0.61: U$3.P$1 73.5,9.6 59.7,9.6 58.6,10.7 58.6,11.5 57.65,12.45 R8.1
N$9
  Top 0.61: R9.1 47.04,9.5 U$4.P$1
N$10
  Top 0.61: U$5.P$1 26.99,16.11 R10.1
N$11
  Bottom 0.508: U$19.P$14 71.54,23.9 72.2,23.9 73,23.1 73,16.7 64.2,7.9 57.18,7.9 U$20.P$2 46.98,20.72 45.8,21.9 45.8,23.8 42.1,27.5 29,27.5 24.09,22.59 U$20.P$3
N$12
  Top 0.406: R1.2 68.4,32.03 68.4,30.32 U$11.P$18
N$13
  Top 0.406: U$11.P$17 71.1,28.89 71.1,30 70.7,30.4 69.7,30.4 69.1,31 69.1,34.2 68.43,34.87 R2.2
N$14
  Top 0.406: U$11.P$16 72.4,28.86 72.4,30.3 72.9,30.8 R3.2
N$15
  Top 0.406: 73.8,28.95 U$11.P$15 73.7,30.2 82.47,38.97 R4.2
N$16
  Top 0.406: U$11.P$14 74.96,29.96 81.85,36.85 R5.2
N$17
  Top 0.406: U$12.P$18 42.13,17.45 R6.2
N$18
  Top 0.406: U$12.P$17 39,19.31 39,18.1 42.05,15.05 R7.2
N$19
  Top 0.406: U$12.P$16 37.6,16.8 41.95,12.45 R8.2
N$20
  Top 0.406: R9.2 45.06,9.5 41.6,9.5 36.32,14.78 U$12.P$15
N$21
  Top 0.406: U$12.P$14 35,19.5 35,20.8 34.6,21.2 29.2,21.2 28.42,20.42 R10.2
N$22
  Top 0.406: 13.55,9.55 U$18.P$1 13.6,19.55 R18.1
N$23
  Top 0.406: U$16.P$15 116.67,30.17 118.22,31.72 R12.1
N$24
  Top 0.406: U1.8 47.82,25.27 Q1.3
N$25
  Top 0.406: U1.7 50.56,25.93 Q1.1
N$26
  Top 0.406: S1.3 S1.4 19.02,22.61 19.7,23.3 19.7,24.06 SJ2.1
N$27
  Top 0.406: 13.55,39.05 U$17.P$1 13.55,38.95 R17.1
N$29
  Top 0.406: SJ3.2 87.51,23.29 87.5,23.3 87.5,24.04 SV1.5
N$31
  Top 0.406: L1.2 84.55,33.85 IC1.4
N$36
  Top 0.406: U$15.P$15 95.6,31.49 R11.1
RESET  (via drill 0.6)
  Top 0.406: C2.1 19.6,28.99 R13.1 | R13.1 19.67,25.13 SJ2.2 | R13.1 19.67,35.07 v21.7,37.1 | U1.29 58.6,28.38 58.6,31.1 v57.9,31.8
  Bottom 0.406: v21.7,37.1 23.2,37.1 23.4,36.9 52.8,36.9 v57.9,31.8
RESET_WIFI
  Top 0.406: SV1.6 81.9,27.1 81.9,29.41 SJ1.1
RXI  (via drill 0.6)
  Top 0.406: 57.2,28.23 U1.30 57.97,28.87 57.97,30.14 v56.3,31.8
  Bottom 0.406: JP1.3 13.71,35.3 49.3,35.3 53.9,30.7 | v56.3,31.8 55.2,30.7 53.9,30.7 | 53.9,30.7 53.9,29.3 54.6,28.6 69.65,28.6 70.67,29.62 | 70.67,29.62 PAD2.1 | SV1.7 84.45,29.62 70.67,29.62
SEGA1
  Top 0.406: U$14.P$13 131.55,33.3 114,33.3 111.4,30.7 102.1,30.7 100.6,29.2 100.68,29.12 U$15.P$11
SEGA2
  Top 0.406: U$13.P$13 144.95,18.35 137.2,26.1 123.84,26.1 U$16.P$11
SEGB1  (via drill 0.6)
  Top 0.406: U$15.P$13 98.14,29.74 100.7,32.3 110.6,32.3 113,34.7 130.3,34.7 v131.7,36.1
  Bottom 0.406: v131.7,36.1 132.26,36.66 134.87,36.66 135.8,37.6 146.01,37.6 U$14.P$9
SEGB2
  Top 0.406: U$13.P$9 155.11,17.89 153.9,19.1 146.8,19.1 138.2,27.7 125.1,27.7 123.9,28.9 123.9,30.3 122.6,31.6 120.3,31.6 119.3,30.6 119.3,28.28 U$16.P$13
SEGC1  (via drill 0.6)
  Top 0.406: U$15.P$17 93.06,25.64 v93.1,25.6
  Bottom 0.406: v93.1,25.6 94.1,24.6 105.6,24.6 109.9,28.9 145.7,28.9 147.1,30.3 149,30.3 149.95,31.25 U$14.P$4
SEGC2  (via drill 0.6)
  Top 0.406: U$16.P$17 114.13,26.37 114.7,25.8 115.4,25.8 v115.5,25.7
  Bottom 0.406: v115.5,25.7 119.7,25.7 120.4,25 128.2,25 150.03,3.17 U$13.P$4
SEGD1  (via drill 0.6)
  Top 0.406: U$15.P$20 89.25,25.65 v89.2,25.6 | v138.5,31.3 140.2,31.3 141.5,30 143.5,30 U$14.P$2
  Bottom 0.406: v89.2,25.6 89.56,25.96 89.56,25.99 91.68,28.1 94.2,28.1 95.3,27 104.4,27 108.5,31.1 138.3,31.1 v138.5,31.3
SEGD2  (via drill 0.6)
  Top 0.406: U$16.P$20 110.3,28.17 110.3,24.8 111.2,23.9 v111.5,23.9
  Bottom 0.406: v111.5,23.9 112,23.4 127.4,23.4 144.95,5.85 U$13.P$2
SEGDP1  (via drill 0.6)
  Top 0.406: U$15.P$19 90.52,25.62 v90.5,25.6
  Bottom 0.406: v90.5,25.6 90.86,25.96 90.86,25.99 92.18,27.3 93.9,27.3 95,26.2 104.8,26.2 108.9,30.3 139.1,30.3 141.5,32.7 146.09,32.7 U$14.P$3
SEGDP2  (via drill 0.6)
  Top 0.406: U$16.P$19 111.5,28.1 v111.5,25.4
  Bottom 0.406: v111.5,25.4 112.2,24.7 117.8,24.7 118.3,24.2 127.9,24.2 147.49,4.61 U$13.P$3
SEGE1  (via drill 0.6)
  Top 0.406: U$15.P$18 v91.79,25.61 v91.8,25.6
  Bottom 0.406: v91.8,25.6 92.17,25.96 92.17,25.99 92.71,26.54 93.67,26.54 94.8,25.4 105.2,25.4 109.4,29.6 128.1,29.6 128.2,29.6 140.55,29.6 U$14.P$1
SEGE2  (via drill 0.6)
  Top 0.406: v110.3,22.6 111.9,22.6 112.86,23.56 U$16.P$18
  Bottom 0.406: v110.3,22.6 110.4,22.5 127,22.5 142.41,7.09 U$13.P$1
SEGF1  (via drill 0.6)
  Top 0.406: U$15.P$12 99.41,29.81 101.1,31.5 111,31.5 113.5,34 131.1,34 136,38.9 v136,39.4
  Bottom 0.406: v136,39.4 141.6,39.4 147.41,45.21 U$14.P$12
SEGF2
  Top 0.406: U$13.P$12 147.45,17.15 137.7,26.9 124.5,26.9 123,28.4 123,30 122.3,30.7 121.2,30.7 120.5,30 120.5,28.21 U$16.P$12
SEGG1  (via drill 0.6)
  Top 0.406: U$15.P$14 96.87,29.77 100.2,33.1 110.2,33.1 112.6,35.5 119.1,35.5 v119.7,36.1
  Bottom 0.406: v119.7,36.1 124,31.8 137.3,31.8 138.9,33.4 150.47,33.4 U$14.P$5
SEGG2  (via drill 0.6)
  Top 0.406: U$16.P$14 118,28.13 118,26.2 118.4,25.8 122.1,25.8 122.5,25.4 129.4,25.4 130.3,24.5 v130.3,24.4
  Bottom 0.406: U$13.P$5 130.3,24.18 v130.3,24.4
TXO  (via drill 0.35, 0.6)
  Top 0.406: U1.31 57.2,29.24 57.2,29.8 56.3,30.7 55.6,30.7 | 55.6,30.7 54.6,31.7 v54.6,31.8 | v55,29.7 55.6,30.3 55.6,30.7 | v66.9,30.9 67.7,30.1 67.7,28.7 70.3,26.1 75.6,26.1 79.9,21.8 80.4,21.8 81.81,20.39 SV1.2
  Bottom 0.406: JP1.2 11.97,36.1 50.3,36.1 v54.6,31.8 | v55,29.7 65.9,29.7 | 65.9,29.7 67.85,29.7 PAD1.1 | v66.9,30.9 66.9,30.7 65.9,29.7
VCC  (via drill 0.55, 0.6)
  Top 0.406: C3.2 50.17,30.47 49.7,30 49.7,27.83 U1.6 51.83,25.7 | 51.83,25.7 52.3,25.7 | 52.3,25.7 53,26.4 53,26.8 U1.4 | R16.2 60.7,30.57 | 60.7,30.57 R15.2 | U1.18 55.9,20.5 | 52.27,25.27 55.9,21.63 55.9,20.5 | 52.27,25.27 51.83,25.7 | 52.27,25.27 52.3,25.3 52.3,25.7 | U$15.P$16 94.33,31.36 94.14,31.55 R11.2 89.41,31.74 IC1.1 | U$16.P$16 115.4,31.23 | 115.4,31.23 115.89,31.71 | 115.89,31.71 R12.2 | 115.06,31.57 115.4,31.23 | R12.2 115.53,32.08 115.3,32.15 | 115.3,32.15 115.53,31.93 115.73,31.71 115.89,31.71 | R12.2 115.73,31.57 115.06,31.57 | 115.06,31.57 115.3,31.8 | 115.3,31.8 115.3,32.15 | 115.3,32.15 114.65,32.15 v114.6,32.2 | 115.06,31.57 114.6,32.03 v114.6,32.2 | v114.6,32.2 115,31.8 115.3,31.8 | v60.7,32 60.7,30.57 | U$7.P$2 57.6,39 58.2,38.4 v58.2,36.9 | 55.9,20.5 55.4,21 v54.7,21 | v58.3,9.2 58,9.5 U$4.P$2 | IC1.3 88.25,33.85 88,33.6 88,32.3 88.35,31.95 IC1.1 | C5.1 90.75,31.95 IC1.1 | v105,3.2 105,3.9 | 105,3.9 105,4.4 | 106.7,4 v106.7,3.2 v103.4,3.2 103.4,4 | 106.7,4 106.7,4.4 | 106.7,4 107.1,4.4 107.2,4.4 | 106.7,4 106.3,4.4 106.2,4.4 | 105,3.9 105.4,4.3 105.4,4.4 | 105,3.9 104.5,4.4 | 103.4,4 103.4,4.3 103.3,4.4 | 103.4,4 103,4.4 102.9,4.4 | 103.4,4 103.8,4.4
  Top 0.61: U$17.P$2 19,41.6 24.9,41.6 | 75.3,41.6 95.2,41.6 | 55.4,41.6 62.4,41.6 | 62.4,41.6 63.7,41.6 | 63.8,41.6 64.6,41.6 | 65.8,41.6 75.3,41.6 | 35.2,41.6 55.4,41.6 | 35.2,41.6 26.4,41.6 | 26.4,41.6 24.9,41.6 | 95.2,41.6 97.6,41.6 | 97.6,41.6 115.5,41.6 116.4,40.7 U$10.P$2 117.7,37.7 v117.7,36.7 | U$9.P$2 96.4,40.4 95.2,41.6 | U$8.P$2 76.4,40.5 75.3,41.6 | U$7.P$2 56.4,40.6 55.4,41.6 | U$6.P$2 36.4,40.4 35.2,41.6 | U$18.P$2 20.1,5.8 | 74.7,5.8 94.7,5.8 | 54.5,5.8 64.6,5.8 | 64.6,5.8 74.7,5.8 | 34.2,5.8 54.5,5.8 | 34.2,5.8 27.9,5.8 | 27.9,5.8 26.9,5.8 | 26.9,5.8 26,5.8 | 26,5.8 20.1,5.8 | U$1.P$2 116.4,7.7 113.1,4.4 107.2,4.4 106.7,4.4 106.2,4.4 105.4,4.4 105,4.4 104.5,4.4 103.8,4.4 103.3,4.4 102.9,4.4 96.1,4.4 94.7,5.8 | U$2.P$2 96.4,7.5 94.7,5.8 | U$3.P$2 76.4,7.5 74.7,5.8 | U$4.P$2 56.5,9.4 56.5,7.8 54.5,5.8 | U$5.P$2 36.4,8 34.2,5.8 | 99,40.2 100,39.2 | 100,39.2 v101,39.2 | 100,39.2 v99,39.2 99,40.2 | 99,40.2 97.6,41.6 | v94.1,35.5 v94.1,33.8 94.1,31.9 | 94.1,31.9 94.1,31.59 94.14,31.55 | 20.1,5.8 12.9,5.8 10.1,8.6 10.1,19.2 6.43,22.87 JP1.4 | 27.9,5.8 27.25,6.45 | 27.25,6.45 26.95,6.75 | 26.95,6.75 21.9,11.8 21.9,28.39 | PAD3.1 64.1,43.3 | 64.1,43.3 63.8,43 | 63.8,43 63.5,42.7 | 63.5,42.7 63.05,42.25 | 63.05,42.25 62.4,41.6 | 64.1,43.3 64.75,42.65 | 64.75,42.65 64.8,42.6 | 64.8,42.6 65.8,41.6 | 65.8,41.6 65.1,41.6 | 65.1,41.6 64.6,41.6 | 64.6,41.6 63.5,42.7 | 64.8,42.6 64.55,42.35 | 64.55,42.35 63.8,41.6 | 63.8,41.6 63.8,43 | 63.8,43 64.45,42.35 64.55,42.35 | 64.75,42.65 64.75,41.95 65.1,41.6 | 63.8,41.6 63.7,41.6 | 63.7,41.6 63.05,42.25 | R13.2 21.9,28.39 | 21.9,28.39 21.9,30.3 25.7,34.1 | 25.7,40.8 24.9,41.6 | 25.7,34.1 25.7,40.8 | 26.4,41.6 26.4,41.5 25.7,40.8
  Top 0.61: 26.95,6.75 26.65,6.45 | 26,5.8 26.65,6.45 | 26.65,6.45 27.25,6.45 | 27.25,6.45 26.9,6.1 26.9,5.8 | v49.2,31.3 50.03,30.47 C3.2 | 25.7,34.1 26.9,32.9 v28.8,32.9 | v114.6,32.2 114.72,32.08 115.53,32.08 | U$15.P$16 94.33,31.67 94.1,31.9 | U$16.P$16 115.4,31.8 115.53,31.93 | 64.6,5.8 v66.4,7.6
  Bottom 0.254: U$21.VBUS3 U$21.VBUS4 103.75,6.65 104.7,5.7 | U$21.VBUS1 U$21.VBUS2 106.25,6.65 105.25,5.65 | 104.7,5.7 105,5.4 105.25,5.65 | 105,3.5 105,3.9 | 104.5,3.2 v105,3.2 105.6,3.2 | 104.7,5.7 105.2,5.7 105.25,5.65
  Bottom 0.406: v60.7,32 58.2,34.5 v58.2,36.9 | v58.3,9.2 54.7,12.8 v54.7,21 | v66.4,7.6 73.7,14.9 73.7,23.2 75.77,25.27 U$19.P$2 | v106.7,3.2 105.6,3.2 | 104.5,3.2 104.3,3.2 | 104.3,3.2 v103.4,3.2 | 105,3.9 104.7,3.6 | 104.7,3.6 104.5,3.4 | 104.5,3.4 104.5,3.2 | 104.5,3.2 105.6,3.2 | 105,3.9 105,5.4 | 104.7,3.6 104.7,3.5 v105,3.2 105,3.5 | 104.5,3.4 104.3,3.2 | 105,3.9 105.6,3.3 105.6,3.2
  Bottom 0.61: v94.1,35.5 96.4,35.5 99,38.1 v99,39.2 v101,39.2 | v28.8,32.9 42.6,32.9 44.2,31.3 v47.7,31.3 v49.2,31.3 | v114.6,32.2 117.7,35.3 v117.7,36.7
VCC_33
  Top 0.406: L1.1 84.65,31.95 IC1.5 | L1.1 83,31.8 | 83,31.8 C4.1 | C4.1 83.15,30.95 | 83.15,30.95 83.53,30.57 | 83.53,30.57 SV1.8 83.53,30.83 84.45,31.75 | 84.45,31.75 L1.1 | L1.1 84,31.8 83.6,31.4 | 83.6,31.4 83.15,30.95 | 83.15,30.95 83.15,31.65 83,31.8 | C4.1 83.2,31.8 83.6,31.4 | 83.53,30.57 84.45,31.49 84.45,31.75
  Bottom 0.406: SV1.8 82,26.48 82,24.46 SV1.4

### Text on the board
tPlace: 5V | GND | TX | RX | GND | * | * | * | 22uF | 1uH | 10uF | GRN | * | * | * | * | * | * | BLK | * | * | *